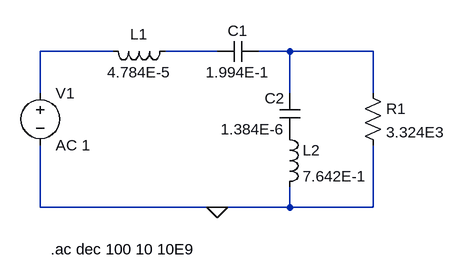
[diagram p0: schematic DoubleLC.asc]
DoubleLC.asc, the LTspice schematic file:
Version 4.1
SHEET 1 880 680
WIRE 208 64 96 64
WIRE 368 64 288 64
WIRE 480 64 432 64
WIRE 608 64 480 64
WIRE 96 128 96 64
WIRE 480 128 480 64
WIRE 608 128 608 64
WIRE 96 304 96 208
WIRE 368 304 96 304
WIRE 480 304 480 272
WIRE 480 304 368 304
WIRE 608 304 608 208
WIRE 608 304 480 304
FLAG 368 304 0
SYMBOL voltage 96 112 R0
SYMATTR InstName V1
SYMATTR Value AC 1
SYMBOL ind 304 48 R90
WINDOW 0 5 56 VBottom 2
WINDOW 3 32 56 VTop 2
SYMATTR InstName L1
SYMATTR Value 4.784E-5
SYMBOL cap 432 48 R90
WINDOW 0 0 32 VBottom 2
WINDOW 3 32 32 VTop 2
SYMATTR InstName C1
SYMATTR Value 1.994E-1
SYMBOL cap 496 192 R180
WINDOW 0 24 56 Left 2
WINDOW 3 24 8 Left 2
SYMATTR InstName C2
SYMATTR Value 1.384E-6
SYMBOL ind 464 176 R0
SYMATTR InstName L2
SYMATTR Value 7.642E-1
SYMBOL res 592 112 R0
SYMATTR InstName R1
SYMATTR Value 3.324E3
TEXT 112 368 Left 2 !.ac dec 100 10 10E9

The netlist it stands for:
* DoubleLC.asc
V1 N001 0 AC 1
L1 N002 N001 4.784E-5
C1 N003 N002 1.994E-1
C2 P001 N003 1.384E-6
L2 P001 0 7.642E-1
R1 N003 0 3.324E3
.ac dec 100 10 10E9
.backanno
.end